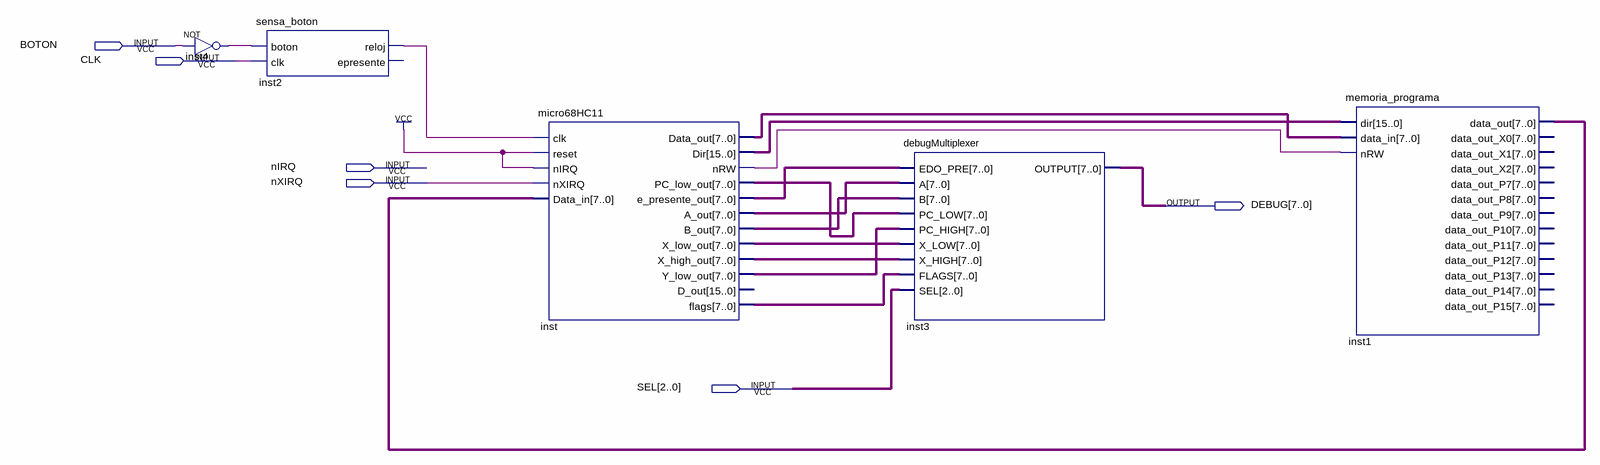
[diagram p0: schematic sheet]
// Quartus schematic 68HC11.bdf as structural Verilog: 5 symbols, 6 pins
module \68HC11  (
  input  BOTON,
  input  CLK,
  input  nIRQ,
  input  nXIRQ,
  input  [2:0] SEL,
  output [7:0] DEBUG
);

  wire inst2_reloj, inst4_out, inst_nrw;
  wire [7:0] inst1_data_out, inst_a_out, inst_b_out, inst_data_out, inst_e_presente_out, inst_flags,
       inst_pc_low_out, inst_x_high_out, inst_x_low_out, inst_y_low_out;
  wire [15:0] inst_dir;

  not inst4 (inst4_out, BOTON);
  sensa_boton inst2 (.boton(inst4_out), .clk(CLK), .reloj(inst2_reloj));  // open: epresente
  micro68HC11 inst (
    .clk(inst2_reloj), .reset(1'b1), .nIRQ(1'b1), .nXIRQ(nXIRQ), .Data_in(inst1_data_out),
    .Data_out(inst_data_out), .Dir(inst_dir), .nRW(inst_nrw), .PC_low_out(inst_pc_low_out),
    .e_presente_out(inst_e_presente_out), .A_out(inst_a_out), .B_out(inst_b_out), .X_low_out(inst_x_low_out),
    .X_high_out(inst_x_high_out), .Y_low_out(inst_y_low_out), .flags(inst_flags));  // open: D_out
  debugMultiplexer inst3 (
    .EDO_PRE(inst_e_presente_out), .A(inst_a_out), .B(inst_b_out), .PC_LOW(inst_pc_low_out),
    .PC_HIGH(inst_y_low_out), .X_LOW(inst_x_low_out), .X_HIGH(inst_x_high_out), .FLAGS(inst_flags),
    .SEL(SEL), .OUTPUT(DEBUG));
  memoria_programa inst1 (
    .dir(inst_dir), .data_in(inst_data_out), .nRW(inst_nrw), .data_out(inst1_data_out));  // open: data_out_X0, data_out_X1, data_out_X2, data_out_P7, data_out_P8, data_out_P9, data_out_P10, data_out_P11, data_out_P12, data_out_P13, data_out_P14, data_out_P15
endmodule
